# EAGLE design BR86_MKL_33961_Fahrwerk_J0_005_01_01 (EAGLE 5.10)
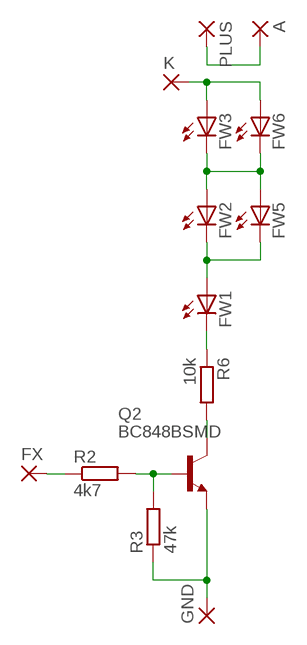
[diagram p0: schematic, sheet 1]

## Parts
A  SMD2  [SMD1,27-2,54]
FW1  LEDCHIP-LED0603  [CHIP-LED0603]
FW2  LEDCHIP-LED0603  [CHIP-LED0603]
FW3  LEDCHIP-LED0603  [CHIP-LED0603]
FW5  LEDCHIP-LED0603  [CHIP-LED0603]
FW6  LEDCHIP-LED0603  [CHIP-LED0603]
FX  SMD2  [SMD1,27-2,54]
GND  SMD2  [SMD1,27-2,54]
K  SMD2  [SMD1,27-2,54]
PLUS  SMD2  [SMD1,27-2,54]
Q2  BC848BSMD  [SOT23]
R2  4k7  R-EU_R0603  [R0603]
R3  47k  R-EU_R0603  [R0603]
R6  10k  R-EU_R0603  [R0603]

## Nets
N$1: A.1(P) PLUS.1(P)
N$2: FW3.A FW6.A K.1(P)
N$3: Q2.3(C) R6.2
N$4: FW1.C R6.1
N$16: FW2.A FW3.C FW5.A FW6.C
N$19: FW1.A FW2.C FW5.C
N$21: Q2.1(B) R2.2 R3.2
N$22: FX.1(P) R2.1
N$23: GND.1(P) Q2.2(E) R3.1

## Library data of the parts
A FX GND K PLUS = wirepad:SMD2: SMD PAD
FW1-FW3 FW5 FW6 = led:LED: LED OSRAM: - CHIPLED LG R971, LG N971, LY N971, LG Q971, LY Q971, LO R971, LY R971 LH N974, LH R974 LS Q976, LO Q976, LY Q976 LO Q996 - Hyper CHIPLED LW Q18S LB Q993, LB Q99A, LB R99A - SideLED LS A670, LO A670, LY A670, LG A670, LP A670 LB A673, LV A673, LT A673, LW A673 LH A674 LY A675 LS A676, LA A676, LO A676, LY A676, LW A676 LS A679, LY A679, LG A679 - Hyper Micro SIDELED® LS Y876, LA Y876, LO Y876, LY Y876 LT Y87S - SmartLED LW L88C, LW L88S LB L89C, LB L89S, LG L890 LS L89K, LO L89K, LY L89K LS L896, LA L896, LO L896, LY L896 - TOPLED LS T670, LO T670, LY T670, LG T670, LP T670 LSG T670, LSP T670, LSY T670, LOP T670, LYG T670 LG T671, LOG T671, LSG T671 LB T673, LV T673, LT T673, LW T673 LH T674 LS T676, LA T676, LO T676, LY T676, LB T676, LH T676, LSB T676, LW T676 LB T67C, LV T67C, LT T67C, LS T67K, LO T67K, LY T67K, LW E67C LS E67B, LA E67B, LO E67B, LY E67B, LB E67C, LV E67C, LT E67C LW T67C LS T679, LY T679, LG T679 LS T770, LO T770, LY T770, LG T770, LP T770 LB T773, LV T773, LT T773, LW T773 LH T774 LS E675, LA E675, LY E675, LS T675 LS T776, LA T776, LO T776, LY T776, LB T776 LHGB T686 LT T68C, LB T68C - Hyper Mini TOPLED® LB M676 - Mini TOPLED Santana® LG M470 LS M47K, LO M47K, LY M47K Source: http://www.osram.convergy.de LUXEON: - LUMILED® LXK2-PW12-R00, LXK2-PW12-S00, LXK2-PW14-U00, LXK2-PW14-V00 LXK2-PM12-R00, LXK2-PM12-S00, LXK2-PM14-U00 LXK2-PE12-Q00, LXK2-PE12-R00, LXK2-PE12-S00, LXK2-PE14-T00, LXK2-PE14-U00 LXK2-PB12-K00, LXK2-PB12-L00, LXK2-PB12-M00, LXK2-PB14-N00, LXK2-PB14-P00, LXK2-PB14-Q00 LXK2-PR12-L00, LXK2-PR12-M00, LXK2-PR14-Q00, LXK2-PR14-R00 LXK2-PD12-Q00, LXK2-PD12-R00, LXK2-PD12-S00 LXK2-PH12-R00, LXK2-PH12-S00 LXK2-PL12-P00, LXK2-PL12-Q00, LXK2-PL12-R00 Source: www.luxeon.com KINGBRIGHT: KA-3528ASYC Source: www.kingbright.com
Q2 = transistor-npn:BC848*: NPN Transistor
R2 R3 R6 = rcl:R-EU_: RESISTOR, European symbol

## Board
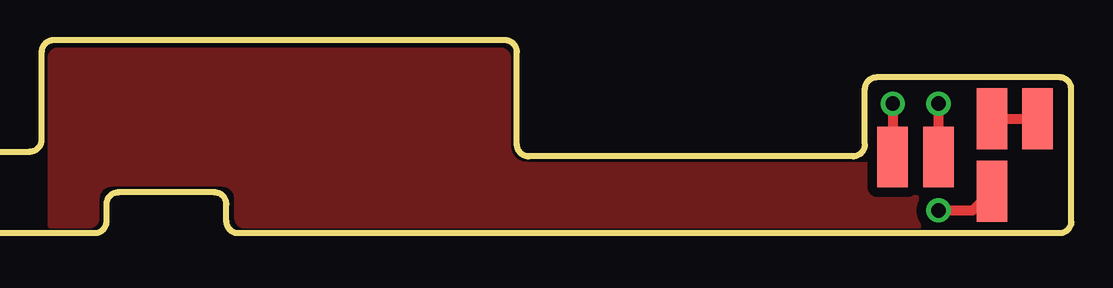
[diagram p1: board, top side]
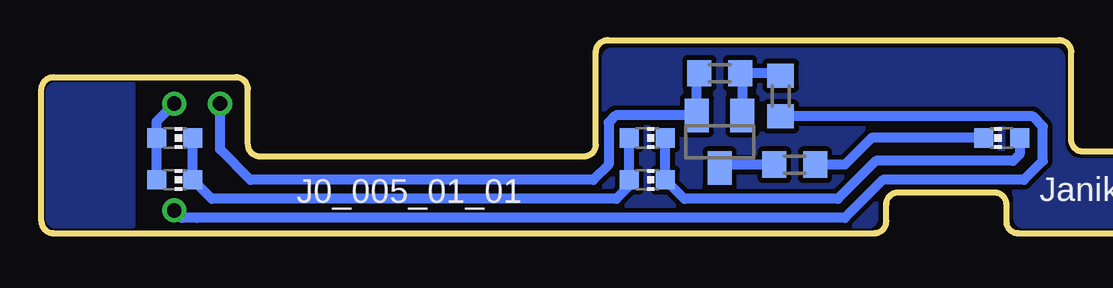
[diagram p2: board, bottom side, seen from below]

No outline drawn. Coordinates in mm, seen from the top.
Copper layers (1*16): Top 0.035mm / dielectric 1.5mm / Bottom 0.035mm
Design rules "default *": minimum track width 7mil, minimum drill 0.6mm, track to track 8mil, track to pad 8mil, pad to pad 8mil, via to via 8mil, smd to smd 8mil, copper to edge 40mil, drill to drill 8mil, minimum pad ring 10mil, minimum via ring 8mil, stop-mask expansion 4mil, vias tented up to drill 0mil, thermal gap 10mil
tKeepout: area 0,0 to 10.1,3.4
bKeepout: area 17,0 to 18.7,8
Milling: 28 lines

### Footprints (pad centres in the part's own frame; a part is rotated, then mirrored left to right if it is on the bottom)
SMD1,27-2,54 = smd 1.27 x 2.54: 1 0,0
CHIP-LED0603 = smd 0.8 x 0.8: A 0,-0.75; C 0,0.75
SOT23 = smd 1 x 1.4: 1 -0.95,-1.1; 2 0.95,-1.1; 3 0,1.1
R0603 = smd 1 x 1.1: 1 -0.85,0; 2 0.85,0

### Placement (x,y rotation side)
A  49.69,4.76 0 top
FW1  12.99,3.97 90 bottom
FW2  27.76,3.97 270 bottom
FW3  47.44,3.97 270 bottom
FW5  27.76,2.22 270 bottom
FW6  47.44,2.22 270 bottom
FX  49.69,1.75 0 top
GND  45.56,3.18 0 top
K  47.47,3.18 180 top
PLUS  51.59,4.76 0 top
Q2  24.74,3.81 180 bottom
R2  22.2,5.71 90 bottom
R3  24.74,6.67 0 bottom
R6  21.61,2.86 180 bottom

### Tracks (layer width: path | path; a pad name or v marks a point on that pad's centre or on a via)
N$1
  Top 0.406: PLUS.1 | A.1 PLUS.1
N$2  (via drill 0.6)
  Top 0.406: v47.47,5.4 K.1
  Bottom 0.406: 47.72,5.15 v47.47,5.4 48.19,4.67 FW3.A | FW6.A FW3.A | FW3.A
N$3
  Bottom 0.406: R6.2 24.59,2.86 Q2.3
N$4
  Bottom 0.406: FW1.C 18.41,3.97 19.53,2.86 R6.1
N$5
  pour Bottom: 49.21,0.32 52.39,0.32 arc90 52.7,0.64 52.7,5.87 arc90 52.39,6.19 49.21,6.19
N$6
  pour Top (isolate 0.406): 10.48,0.32 10.48,7.3 arc-90 10.8,7.62 29.21,7.62 arc-90 29.53,7.3 29.53,3.65 arc90 30.32,2.86 46.67,2.86 46.67,0.32 18.57,0.32 arc-90 18.26,0.64 18.26,1.43 arc90 17.62,2.06 13.02,2.06 arc90 12.38,1.43 12.38,0.64 arc-90 12.07,0.32
N$7
  pour Bottom: 0.64,3.02 arc90 0.32,2.7 0.32,0.64 arc90 0.64,0.32 12.06,0.32 arc90 12.38,0.64 12.38,1.43 arc-90 13.02,2.06 17.62,2.06 arc-90 18.26,1.43 18.26,0.64 arc90 18.57,0.32 29.53,0.32 29.53,7.3 arc90 29.21,7.62 10.79,7.62 arc90 10.48,7.3 10.48,3.81 arc-90 9.68,3.02
N$16
  Bottom 0.406: FW2.A | FW2.A FW5.A 28.51,1.97 29.05,1.43 45.9,1.43 FW6.C FW3.C | FW3.C
N$19
  Bottom 0.406: FW1.A 12.24,3.29 12.52,3.02 18.23,3.02 19.82,1.43 26.21,1.43 FW5.C FW2.C | FW2.C
N$21
  Bottom 0.406: R2.2 22.3,6.67 R3.2 23.79,6.57 Q2.1
N$22  (via drill 0.6)
  Top 0.406: v47.47,0.95 48.9,0.95 FX.1
  Bottom 0.406: R2.1 11.69,4.87 11.27,4.45 11.27,3.02 12.06,2.22 17.94,2.22 19.53,0.64 46.51,0.64 47.15,0.64 v47.47,0.95
N$23  (via drill 0.6)
  Top 0.406: v45.56,5.4 | v45.56,5.4 GND.1
  Bottom 0.406: R3.1 25.69,6.57 Q2.2 29.06,4.91 29.37,4.6 29.37,2.86 30,2.22 44.29,2.22 45.56,3.49 v45.56,5.4

### Text on the board
bNames: JanikLib | J0_005_01_01
tStop: BR86 LED | Fahrwerksbel. | design by Janik Merz